# EAGLE design SNES-GamePad (EAGLE 6.2)
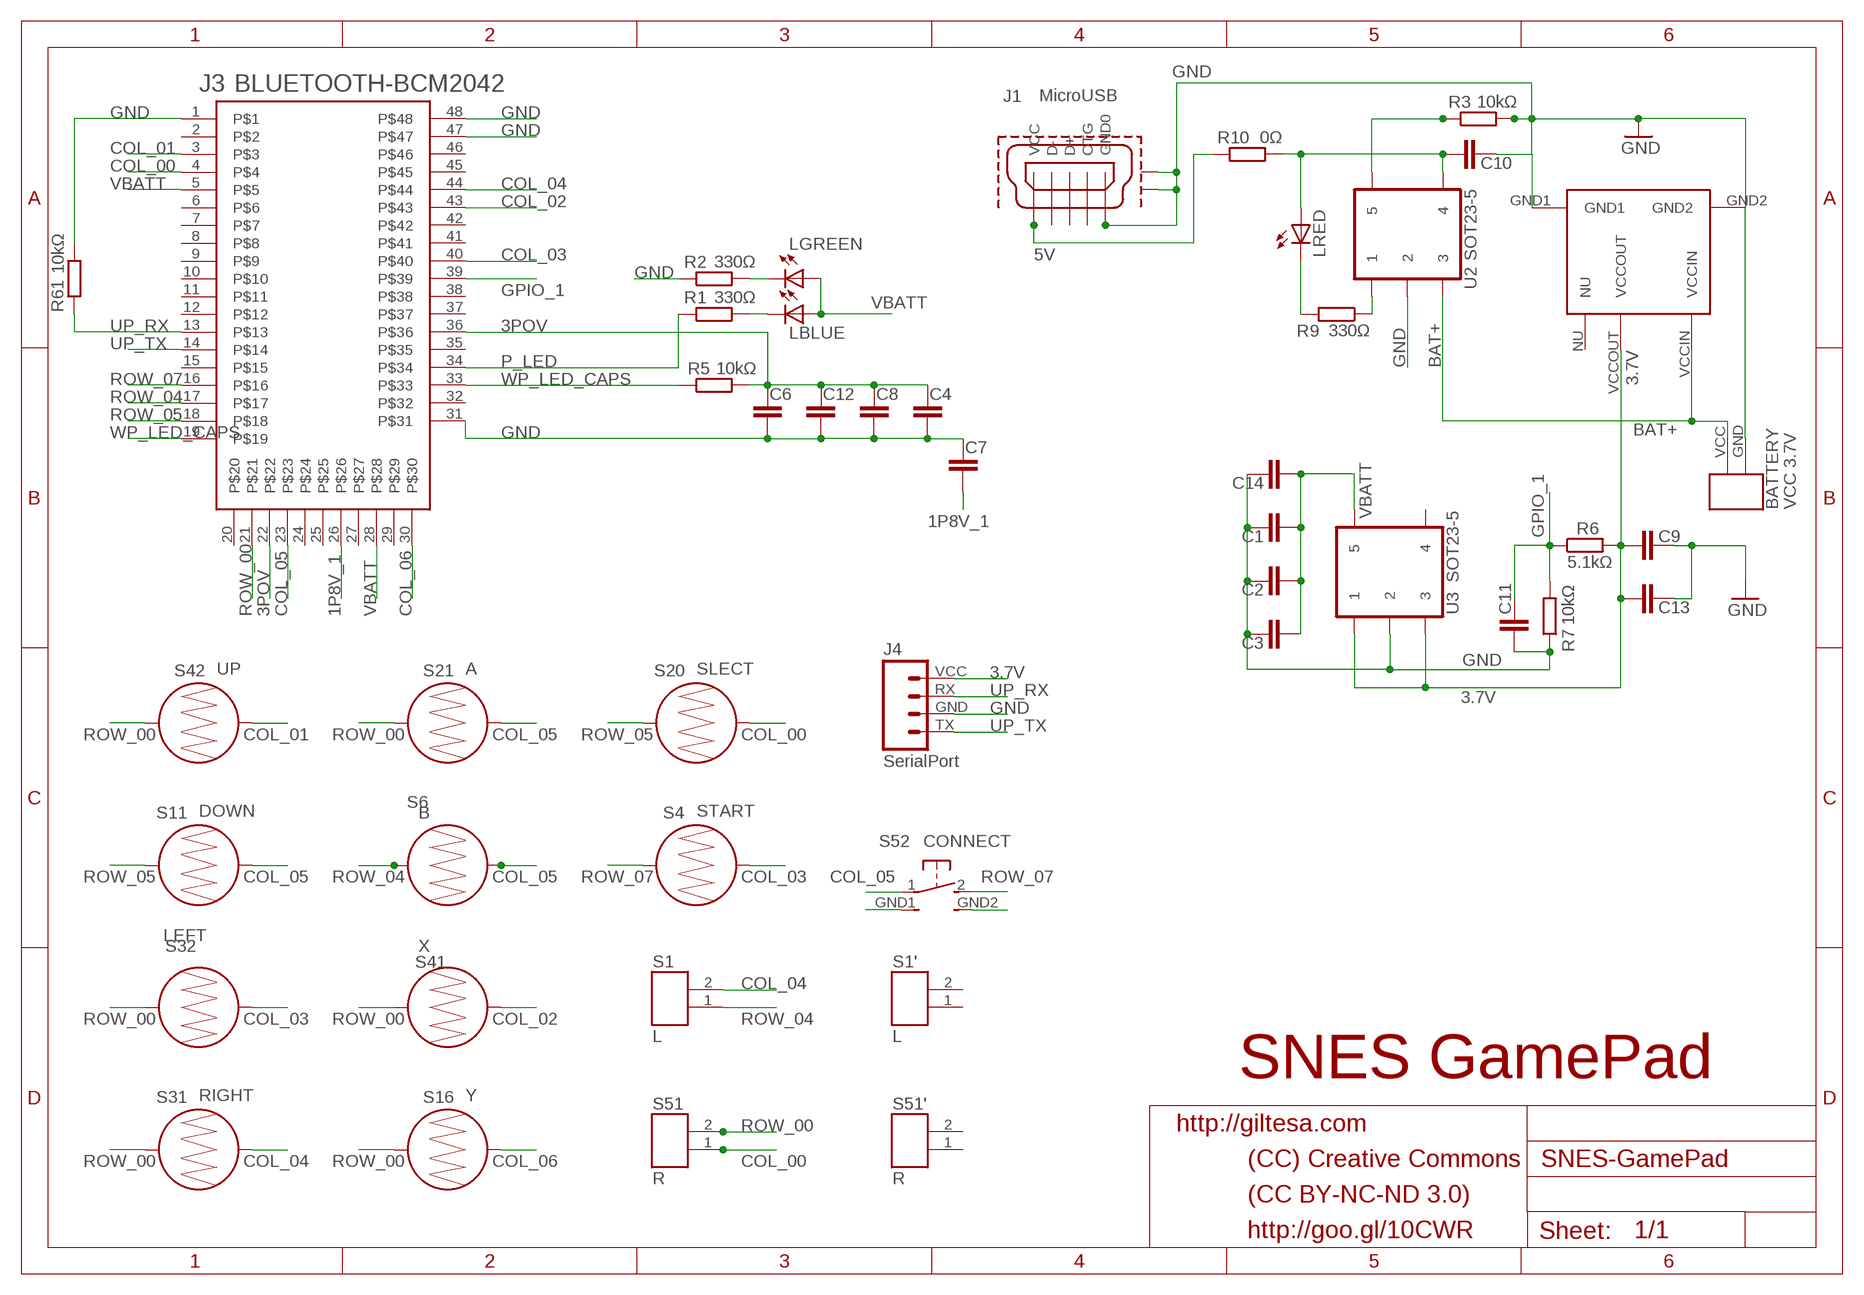
[diagram p0: schematic, sheet 1]

## Parts
BATTERY  VCC 3.7V  1X02_SMD_BIG  [1X02_SMD_BIG]
C1  C-EUC0603  [C0603]
C2  C-EUC0805  [C0805]
C3  C-EUC0805  [C0805]
C4  C-EUC0603  [C0603]
C6  C-EUC0805  [C0805]
C7  C-EUC0805  [C0805]
C8  C-EUC0805  [C0805]
C9  C-EUC0805  [C0805]
C10  C-EUC0603  [C0603]
C11  C-EUC0603  [C0603]
C12  C-EUC0805  [C0805]
C13  C-EUC0805  [C0805]
C14  C-EUC0805  [C0805]
J1  MicroUSB  MICRO_USB_1  [MICRO_USB_1]
J2  INTERRUPTOR_1  [INTERRUPTOR_1]
J3  BLUETOOTH-BCM2042  [BLUETOOTH-BCM2042]
J4  SerialPort  ISP_PORT_SNES  [ISP_PORT_SNES]
LBLUE  LEDCHIPLED_0805  [CHIPLED_0805]
LGREEN  LEDCHIPLED_0805  [CHIPLED_0805]
LRED  LEDCHIPLED_0805  [CHIPLED_0805]
R1  330Ω  R-EU_R0603  [R0603]
R2  330Ω  R-EU_R0603  [R0603]
R3  10kΩ  R-EU_R0603  [R0603]
R5  10kΩ  R-EU_R0603  [R0603]
R6  5.1kΩ  R-EU_R0603  [R0603]
R7  10kΩ  R-EU_R0603  [R0603]
R9  330Ω  R-EU_R0603  [R0603]
R10  0Ω  R-EU_R0603  [R0603]
R61  10kΩ  R-EU_R0603  [R0603]
S1  L  1X02_SMD  [1X02_SMD]
S1'  L  SNES_GAMEPAD_RL  [SNES_GAMEPAD_RL]
S4  START  BUTTON-CONDUCTIVE-BUTTON  [BUTTON-CONDUCTIVE-BUTTON]
S6  B  BUTTON-CONDUCTIVE-BUTTON  [BUTTON-CONDUCTIVE-BUTTON]
S11  DOWN  BUTTON-CONDUCTIVE-PAD  [BUTTON-CONDUCTIVE-PAD]
S16  Y  BUTTON-CONDUCTIVE-BUTTON  [BUTTON-CONDUCTIVE-BUTTON]
S20  SLECT  BUTTON-CONDUCTIVE-BUTTON  [BUTTON-CONDUCTIVE-BUTTON]
S21  A  BUTTON-CONDUCTIVE-BUTTON  [BUTTON-CONDUCTIVE-BUTTON]
S31  RIGHT  BUTTON-CONDUCTIVE-PAD  [BUTTON-CONDUCTIVE-PAD]
S32  LEFT  BUTTON-CONDUCTIVE-PAD  [BUTTON-CONDUCTIVE-PAD]
S41  X  BUTTON-CONDUCTIVE-BUTTON  [BUTTON-CONDUCTIVE-BUTTON]
S42  UP  BUTTON-CONDUCTIVE-PAD  [BUTTON-CONDUCTIVE-PAD]
S51  R  1X02_SMD  [1X02_SMD]
S51'  R  SNES_GAMEPAD_RL  [SNES_GAMEPAD_RL]
S52  CONNECT  SWITCH-90º  [SWITCH-90º]
U2  SOT23-5  [SOT23-5]
U3  SOT23-5  [SOT23-5]

## Nets
1P8V_1: C7.1 J3.26
3.7V: C9.2 C13.2 J2.VCCOUT J4.VCC R6.2 U3.1 U3.3
3POV: C4.1 C6.1 C8.1 C12.1 J3.22 J3.36 R5.2
5V: J1.VCC R10.1
BAT+: BATTERY.VCC J2.VCCIN U2.3
COL_00: J3.4 S20.2 S51.1
COL_01: J3.3 S42.2
COL_02: J3.43 S41.1
COL_03: J3.40 S4.2 S32.1
COL_04: J3.44 S1.2 S31.2
COL_05: J3.23 S6.1 S11.2 S21.2 S52.1
COL_06: J3.30 S16.2
GND: BATTERY.GND C1.1 C2.1 C3.1 C4.2 C6.2 C7.2 C8.2 C9.1 C10.2 C11.1 C12.2 C13.1 C14.1 J1.GND0 J1.GND1 J1.GND2 J2.GND1 J2.GND2 J3.1 J3.31 J3.47 J3.48 J4.GND R2.1 R3.2 R7.1 R61.2 S52.GND1 S52.GND2 U2.2 U3.2
GPIO_1: C11.2 J3.39 R6.1 R7.2
N$5: LBLUE.C R1.2
N$6: C10.1 LRED.A R10.2 U2.4
N$7: J1.D+
N$17: LRED.C R9.2
N$19: R3.1 U2.5
N$30: LGREEN.C R2.2
N$37: R9.1 U2.1
P_LED: J3.34 R1.1
ROW_00: J3.21 S16.1 S21.1 S31.1 S32.2 S41.2 S42.1 S51.2
ROW_04: J3.17 S1.1 S6.2
ROW_05: J3.18 S11.1 S20.1
ROW_07: J3.16 S4.1 S52.2
UP_RX: J3.13 J4.RX R61.1
UP_TX: J3.14 J4.TX
VBATT: C1.2 C2.2 C3.2 C14.2 J3.5 J3.28 LBLUE.A LGREEN.A U3.5
WP_LED_CAPS: J3.19 J3.33 R5.1
Unconnected: J1.D- J1.OTG J2.NU J3.2 J3.6 J3.7 J3.8 J3.9 J3.10 J3.11 J3.12 J3.15 J3.20 J3.24 J3.25 J3.27 J3.29 J3.32 J3.35 J3.37 J3.38 J3.41 J3.42 J3.45 J3.46 S1'.1 S1'.2 S51'.1 S51'.2 U3.4

## Notes on the sheet
- SNES GamePad
- http://giltesa.com
- (CC) Creative Commons
- (CC BY-NC-ND 3.0)
- http://goo.gl/10CWR

## Library data of the parts
BATTERY = ,giltesa:1X02_SMD_BIG
C1-C4 C6-C14 = rcl:C-EU: CAPACITOR, European symbol
J1 = ,giltesa:MICRO_USB_1
J2 = ,giltesa:INTERRUPTOR_1
J3 = ,giltesa:BLUETOOTH-BCM2042
J4 = ,giltesa:ISP_PORT_SNES
LBLUE LGREEN LRED = led:LED: LED OSRAM: - CHIPLED LG R971, LG N971, LY N971, LG Q971, LY Q971, LO R971, LY R971 LH N974, LH R974 LS Q976, LO Q976, LY Q976 LO Q996 - Hyper CHIPLED LW Q18S LB Q993, LB Q99A, LB R99A - SideLED LS A670, LO A670, LY A670, LG A670, LP A670 LB A673, LV A673, LT A673, LW A673 LH A674 LY A675 LS A676, LA A676, LO A676, LY A676, LW A676 LS A679, LY A679, LG A679 - Hyper Micro SIDELED® LS Y876, LA Y876, LO Y876, LY Y876 LT Y87S - SmartLED LW L88C, LW L88S LB L89C, LB L89S, LG L890 LS L89K, LO L89K, LY L89K LS L896, LA L896, LO L896, LY L896 - TOPLED LS T670, LO T670, LY T670, LG T670, LP T670 LSG T670, LSP T670, LSY T670, LOP T670, LYG T670 LG T671, LOG T671, LSG T671 LB T673, LV T673, LT T673, LW T673 LH T674 LS T676, LA T676, LO T676, LY T676, LB T676, LH T676, LSB T676, LW T676 LB T67C, LV T67C, LT T67C, LS T67K, LO T67K, LY T67K, LW E67C LS E67B, LA E67B, LO E67B, LY E67B, LB E67C, LV E67C, LT E67C LW T67C LS T679, LY T679, LG T679 LS T770, LO T770, LY T770, LG T770, LP T770 LB T773, LV T773, LT T773, LW T773 LH T774 LS E675, LA E675, LY E675, LS T675 LS T776, LA T776, LO T776, LY T776, LB T776 LHGB T686 LT T68C, LB T68C - Hyper Mini TOPLED® LB M676 - Mini TOPLED Santana® LG M470 LS M47K, LO M47K, LY M47K Source: http://www.osram.convergy.de LUXEON: - LUMILED® LXK2-PW12-R00, LXK2-PW12-S00, LXK2-PW14-U00, LXK2-PW14-V00 LXK2-PM12-R00, LXK2-PM12-S00, LXK2-PM14-U00 LXK2-PE12-Q00, LXK2-PE12-R00, LXK2-PE12-S00, LXK2-PE14-T00, LXK2-PE14-U00 LXK2-PB12-K00, LXK2-PB12-L00, LXK2-PB12-M00, LXK2-PB14-N00, LXK2-PB14-P00, LXK2-PB14-Q00 LXK2-PR12-L00, LXK2-PR12-M00, LXK2-PR14-Q00, LXK2-PR14-R00 LXK2-PD12-Q00, LXK2-PD12-R00, LXK2-PD12-S00 LXK2-PH12-R00, LXK2-PH12-S00 LXK2-PL12-P00, LXK2-PL12-Q00, LXK2-PL12-R00 Source: www.luxeon.com KINGBRIGHT: KA-3528ASYC Source: www.kingbright.com
R1-R3 R5-R7 R9 R10 R61 = rcl:R-EU_: RESISTOR, European symbol
S1 S51 = ,giltesa:1X02_SMD
S1' S51' = ,giltesa:SNES_GAMEPAD_RL
S4 S6 S16 S20 S21 S41 = ,giltesa:BUTTON-CONDUCTIVE-BUTTON
S11 S31 S32 S42 = ,giltesa:BUTTON-CONDUCTIVE-PAD
S52 = ,giltesa:SWITCH-90º
U2 U3 = ,giltesa:SOT23-5

## Board
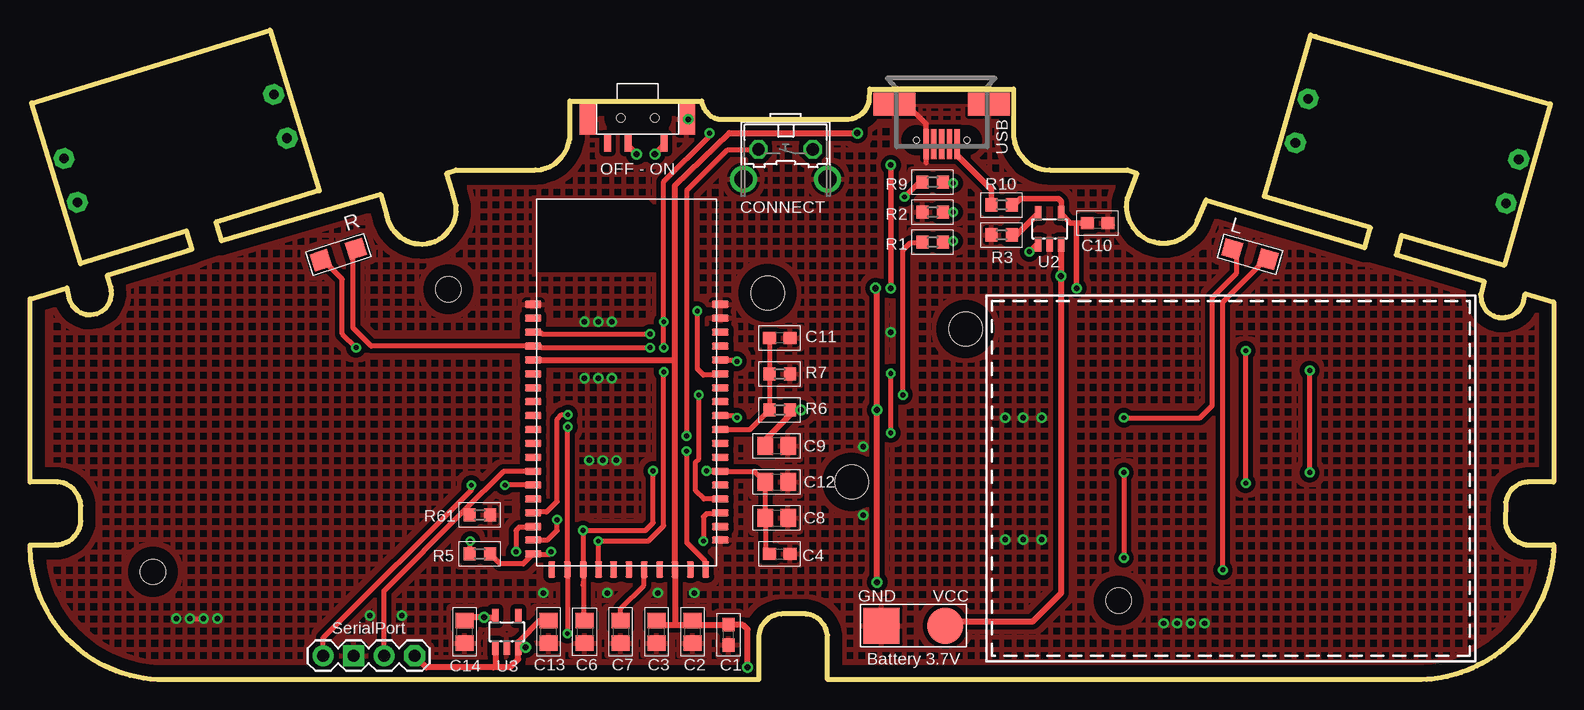
[diagram p1: board, top side]
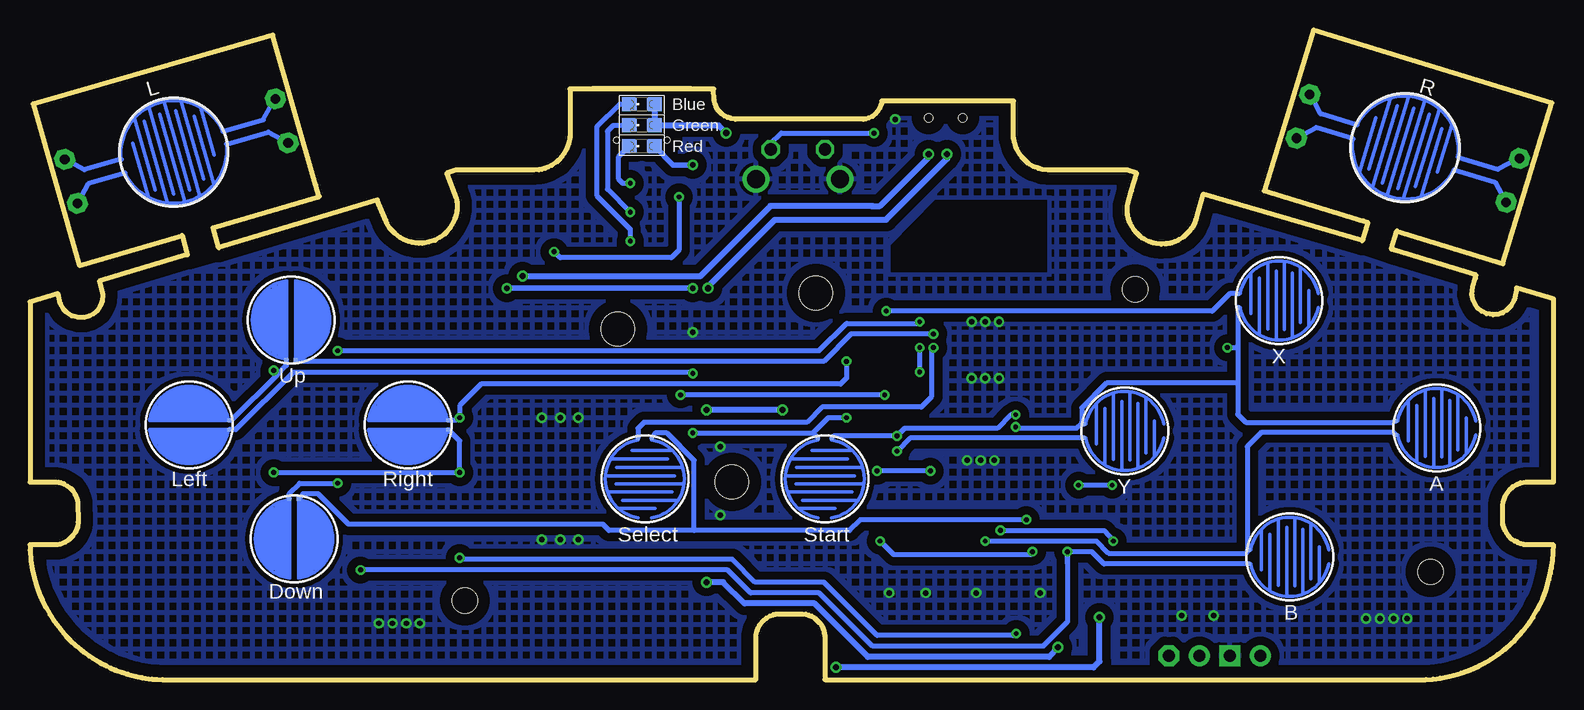
[diagram p2: board, bottom side, seen from below]

Size 127 x 54.18 mm. Coordinates in mm from the lower left corner, seen from the top.
Outline: 0,16.48 0,31.75 3.07,32.66 3.28,31.67 3.56,31.14 3.94,30.79 4.22,30.61 4.65,30.46 5.03,30.43 5.59,30.53 5.99,30.73 6.3,30.96 6.53,31.29 6.71,31.62 6.81,32.11 6.78,32.46 6.73,32.77 6.5,33.45 6.45,33.73 13.16,35.79 13.51,35.89 13.06,37.41 4.22,34.7 0.13,48.08 20.01,54.18 20.14,53.75 24.11,40.77 15.82,38.25 15.49,38.15 15.95,36.6 29.21,40.49 29.72,38.76 29.77,38.58 29.82,38.38 29.9,38.18 30.12,37.72 30.2,37.62 30.33,37.44 30.43,37.31 30.63,37.11 30.79,36.98 30.91,36.88 31.19,36.7 31.32,36.63 31.52,36.55 31.78,36.45 31.95,36.4 32.08,36.37 32.26,36.35 32.36,36.35 32.72,36.32 33.12,36.37 33.35,36.42 33.55,36.47 33.76,36.55 34.14,36.75 34.32,36.85 34.44,36.96 34.75,37.24 34.98,37.52 35.18,37.85 35.31,38.07 35.43,38.46 35.51,38.79 35.54,39.01 35.54,39.55 35.18,40.77 34.75,42.24 35.51,42.49 42.11,42.49 42.62,42.54 42.95,42.65 43.36,42.8 43.76,43.05 44.07,43.31 44.3,43.56 44.53,43.87 44.76,44.3 44.91,44.75 44.98,45.03 45.01,45.16 45.01,48.25 55.98,48.25 56.03,48.01 56.06,47.95 56.19,47.62 56.34,47.4 56.57,47.14 56.77,46.99 57.07,46.84 57.35,46.76 57.56,46.74 68.22,46.74 68.55,46.79 68.86,46.89 69.11,47.02 69.32,47.17 69.57,47.42 69.67,47.55 69.82,47.83 69.9,48.03 69.95,48.18 69.98,48.34 70,49.25 81.99,49.25 81.99,45.26 82.09,44.7 82.22,44.37 82.32,44.14 82.47,43.89 82.65,43.64 82.93,43.33 83.16,43.13 83.52,42.9 83.8,42.75 84.05,42.65 84.33,42.57 84.58,42.52 85.01,42.49 91.52,42.49 92.25,42.24 91.46,40.16 91.41,39.83 91.39,39.45 91.41,39.14 91.49,38.73 91.57,38.51 91.59,38.38 91.72,38.12 91.97,37.69 92.28,37.31 92.48,37.13 92.84,36.88 93.22,36.65 93.75,36.5 94.11,36.42 94.28,36.4 94.59,36.4 94.87,36.42 95.17,36.47 95.45,36.55 95.66,36.63 95.88,36.73 96.14,36.88 96.37,37.03 96.57,37.21 96.75,37.36 96.9,37.54 97,37.67 97.26,38.07 97.33,38.25 98.04,40 111.25,36.02 111.73,37.69 102.89,40.28 103.17,41.25 106.76,53.75 107.19,53.62 126.75,48.01 122.88,34.54 114.32,37.03 113.89,35.43 121.21,33.22 120.93,32.13 120.98,31.57 121.16,31.14 121.41,30.76 121.72,30.51 122.02,30.33 122.45,30.2 122.99,30.2 123.55,30.35 123.98,30.66 124.18,30.89 124.46,31.37 124.66,32.18 127,31.5 127,16.48 124.84,16.48 124.61,16.46 124.41,16.41 124.18,16.33 123.88,16.15 123.65,15.98 123.44,15.77 123.24,15.44 123.09,15.11 123.01,14.81 122.99,13.13 123.04,12.78 123.24,12.27 123.42,11.99 123.82,11.63 124.05,11.48 124.48,11.3 124.69,11.25 127,11.25 127,10.8 126.92,9.91 126.8,9.2 126.64,8.51 126.47,7.9 126.34,7.52 126.14,6.99 125.98,6.63 125.7,6.07 125.32,5.41 124.94,4.83 123.98,3.63 123.67,3.33 123.16,2.85 122.78,2.52 122.53,2.31 122.07,1.98 121.79,1.8 121.46,1.6 121.16,1.42 120.62,1.14 120.29,0.99 119.84,0.79 119.33,0.61 118.85,0.46 118.19,0.28 117.65,0.18 116.81,0.05 116.43,0.03 115.98,0 66.5,0 66.5,3.71 66.4,4.09 66.32,4.29 66.19,4.55 65.89,4.93 65.61,5.16 65.33,5.31 65.02,5.41 64.85,5.46 64.67,5.49 62.64,5.49 62.33,5.46 62.1,5.38 61.85,5.28 61.62,5.16 61.42,5 61.19,4.75 60.98,4.47 60.91,4.29 60.86,4.17 60.78,3.86 60.73,3.63 60.73,0 10.64,0 10.06,0.05 9.45,0.13 8.33,0.36 7.72,0.53 7.16,0.74 6.65,0.94 6.17,1.17 5.77,1.37 5.26,1.68 4.65,2.08 4.06,2.54 3.5,3.02 3.23,3.3 2.85,3.71 2.54,4.06 2.29,4.39 1.98,4.8 1.73,5.18 1.4,5.77 1.09,6.33 0.91,6.73 0.61,7.54 0.38,8.33 0.25,8.86 0.18,9.3 0.08,9.93 0,11.23 2.13,11.25 2.36,11.25 2.49,11.28 2.72,11.33 3,11.43 3.25,11.56 3.5,11.73 3.73,11.99 3.91,12.22 4.04,12.45 4.12,12.6 4.22,12.93 4.24,13.23 4.24,14.53 4.19,14.86 4.17,14.96 4.04,15.32 3.66,15.85 3.4,16.08 3.07,16.28 2.77,16.41 2.31,16.48 0,16.48
Copper layers (1*16): Top 0.035mm / dielectric 1.5mm / Bottom 0.035mm
Design rules: minimum track width 10mil, minimum drill 24mil, track to track 8mil, track to pad 8mil, pad to pad 8mil, via to via 8mil, smd to smd 8mil, copper to edge 40mil, drill to drill 8mil, minimum pad ring 10mil, minimum via ring 8mil, stop-mask expansion 4mil, vias tented up to drill 25mil, thermal gap 10mil
Holes 2.8 mm at 61.5,32.24 78,29.24 68.5,16.49
Holes 2.1 mm at 10.25,8.99 90.75,6.59 34.87,32.57

### Footprints (pad centres in the part's own frame; a part is rotated, then mirrored left to right if it is on the bottom)
1X02_SMD_BIG = smd 3 x 3: GND -2.75,0; VCC 2.56,0
C0603 = smd 1.1 x 1: 1 -0.85,0; 2 0.85,0
C0805 = smd 1.3 x 1.5: 1 -0.95,0; 2 0.95,0
MICRO_USB_1 = smd 2.5 x 0.45: D+ 3.35,0; D- 3.35,0.65; GND0 3.35,-1.3; OTG 3.35,-0.65; VCC 3.35,1.3 | smd 1.9 x 3.5: GND1 0,3.95; GND2 0,-3.95 | hole 0.5: 3,2.1; 3,-2.1
INTERRUPTOR_1 = smd 1.4 x 2.54: GND1 -0.75,1.232; GND2 7.5,1.232 | smd 0.6 x 1.4: NU 0.9,-0.75; VCCIN 5.6,-0.75; VCCOUT 2.6,-0.75 | hole 0.7: 2,1.36; 4.85,1.36
BLUETOOTH-BCM2042 = smd 1.4 x 0.6: 1 -0.3,21.81; 2 -0.3,20.65; 3 -0.3,19.49; 4 -0.3,18.33; 5 -0.3,17.17; 6 -0.3,16.01; 7 -0.3,14.85; 8 -0.3,13.69; 9 -0.3,12.53; 10 -0.3,11.37; 11 -0.3,10.21; 12 -0.3,9.05; 13 -0.3,7.89; 14 -0.3,6.73; 15 -0.3,5.57; 16 -0.3,4.42; 17 -0.3,3.27; 18 -0.3,2.15; 19 -0.3,1; 31 15.3,2.15; 32 15.3,3.27; 33 15.3,4.42; 34 15.3,5.57; 35 15.3,6.73; 36 15.3,7.89; 37 15.3,9.05; 38 15.3,10.21; 39 15.3,11.37; 40 15.3,12.53; 41 15.3,13.69; 42 15.3,14.85; 43 15.3,16.01; 44 15.3,17.17; 45 15.3,18.33; 46 15.3,19.49; 47 15.3,20.65; 48 15.3,21.81 | smd 0.6 x 1.4: 20 1.25,-0.3; 21 2.55,-0.3; 22 3.88,-0.3; 23 5.15,-0.3; 24 6.4,-0.3; 25 7.68,-0.3; 26 8.96,-0.3; 27 10.24,-0.3; 28 11.52,-0.3; 29 12.8,-0.3; 30 14.08,-0.3
ISP_PORT_SNES = drill 1.016 pad 1.778 square: GND -1.27,0 | drill 1.016 pad 1.778: RX 1.27,0; TX -3.81,0 | drill 1.016 pad 1.778 octagon: VCC 3.81,0
CHIPLED_0805 = smd 1.2 x 1.2: A 0,-1.05; C 0,1.05
R0603 = smd 1 x 1.1: 1 -0.85,0; 2 0.85,0
1X02_SMD = smd 1.5 x 1.5: 1 -1.48,0.02; 2 1.58,0.02
SNES_GAMEPAD_RL = drill 0.8 pad 1.676 octagon: 1 1.27,5.08; 1' 19.55,5.08; 2 1.27,1.27; 2' 19.55,1.27
BUTTON-CONDUCTIVE-BUTTON = smd 0.305 x 0.305: 1 3.41,-0.577; 2 3.412,0.577
BUTTON-CONDUCTIVE-PAD = smd 0.305 x 0.305: 1 -3.334,0.396; 2 -3.334,-0.396
SWITCH-90º = drill 1.016 octagon: 1 -2.261,-1.245; 2 2.261,-1.245 | drill 1.499 pad 2.159: GND1 -3.505,1.245; GND2 3.505,1.245
SOT23-5 = smd 0.55 x 1.2: 1 -0.95,-1.3; 2 0,-1.3; 3 0.95,-1.3; 4 0.95,1.3; 5 -0.95,1.3

### Placement (x,y rotation side)
BATTERY  73.75,4.49 0 top
C1  58.25,3.74 90 top
C2  55.25,3.99 90 top
C3  52.25,3.99 90 top
C4  62.5,10.49 0 top
C6  46.25,3.99 270 top
C7  49.25,3.99 270 top
C8  62.25,13.49 0 top
C9  62.25,19.49 180 top
C10  89,38.09 0 top
C11  62.5,28.49 180 top
C12  62.25,16.49 0 top
C13  43.25,3.99 90 top
C14  36.25,3.99 90 top
J1  76,47.99 270 top
J2  47.25,45.49 0 top
J3  42.25,9.49 0 top
J4  28.25,1.99 0 top
LBLUE  76,47.99 90 bottom
LGREEN  76,46.24 90 bottom
LRED  76,44.49 90 bottom
R1  75.25,36.49 0 top
R2  75.25,38.99 0 top
R3  81,37.09 180 top
R5  37.5,10.49 180 top
R6  62.5,22.49 0 top
R7  62.5,25.49 180 top
R9  75.25,41.49 0 top
R10  81,39.59 0 top
R61  37.5,13.74 0 top
S1  101.75,35.49 164 top
S1'  123.93,38.16 16 bottom
S4  60.75,16.74 90 bottom
S6  22,10.24 180 bottom
S11  105,11.74 270 bottom
S16  35.75,20.74 180 bottom
S20  75.75,16.74 90 bottom
S21  9.75,20.99 180 bottom
S31  95.5,21.24 180 bottom
S32  113.75,21.24 180 bottom
S41  22.87,31.61 180 bottom
S42  105.25,29.99 90 bottom
S51  25.75,35.49 198 top
S51'  23.02,44.32 343 bottom
S52  62.99,42.98 180 top
U2  85,37.59 0 top
U3  39.75,3.99 0 top

### Tracks (layer width: path | path; a pad name or v marks a point on that pad's centre or on a via)
1P8V_1
  Top 0.406: C7.1 49.25,5.94 51.18,7.87 51.18,9.17 J3.26
3.7V  (via drill 0.51)
  Top 0.508: 63.36,22.48 R6.2 | R6.2 63.35,22.07 61.34,20.07 61.34,19.54 C9.2 | R6.2 64.25,22.49 v64.26,22.48 | U3.3 v41.3,2.69 | 38.61,1.02 40.01,1.02 40.7,1.71 U3.3 | 38.61,1.02 33.03,1.02 J4.VCC | U3.1 38.8,1.2 38.61,1.02 | C13.2 42.53,4.94 40.77,3.17 40.77,2.76 U3.3 | v70.61,8.13 v70.61,22.48 70.61,32.51 v70.48,32.64 | J2.VCCOUT 49.85,44.53 v50.56,43.81
  Bottom 0.508: v41.3,2.69 41.3,2.64 42.04,1.9 57.15,1.9 61.59,6.35 67.44,6.35 69.21,8.13 v70.61,8.13 | v64.26,22.48 v70.61,22.48 70.48,22.61 | v70.48,32.64 70.36,32.89 64.9,38.35 55.63,38.35 50.55,43.43 50.55,43.8 v50.56,43.81
3POV  (via drill 0.41)
  Top 0.406: C4.1 61.3,10.84 C8.1 C12.1 60.41,17.38 J3.36 57.44,17.4 v56.39,17.4 | J3.22 46.13,5.06 | J3.22 46.13,8.15 46.1,7.87 | R5.2 36.7,10.43 v36.7,11.56 | J3.22 46.1,9.22 v46.1,12.45 51.31,12.45 51.94,13.08 v51.94,17.4
  Top 0.508: 46.13,5.06 C6.1
  Bottom 0.406: v51.94,17.4 v56.39,17.4 | v46.1,12.45 37.47,12.45 v36.7,11.56
5V
  Top 0.457: J1.VCC 77.3,43.71 80.15,40.86 R10.1
BAT+  (via drill 0.51)
  Top 0.508: BATTERY.VCC 76.64,4.83 83.57,4.83 85.95,7.21 v85.95,33.65 U2.3 | J2.VCCIN 52.85,44.57 v52.09,43.81
  Bottom 0.508: v85.95,33.65 71.12,33.65 65.28,39.5 56.9,39.5 56.9,39.51 56.78,39.51 56.77,39.5 56.13,39.5 52.07,43.56 52.07,43.8 v52.09,43.81
COL_00  (via drill 0.41)
  Top 0.406: 27.3,35.78 S51.1 26.92,35.7 26.92,29.34 28.44,27.82 J3.4 42.54,27.82 42.67,27.69 v51.69,27.69
  Bottom 0.406: S20.2 76.33,20.33 76.33,20.96 75.82,21.46 62.23,21.46 60.96,22.73 52.71,22.73 51.82,23.62 51.82,27.56 v51.69,27.69
COL_01  (via drill 0.41)
  Top 0.406: J3.3 42.52,28.98 42.67,28.83 v51.69,28.83
  Bottom 0.406: v51.69,28.83 58.55,28.83 60.83,26.54 104.74,26.54 S42.2
COL_02  (via drill 0.41)
  Top 0.406: J3.43 57.44,25.4 56.13,25.4 55.63,25.91 v55.63,30.73
  Bottom 0.406: v55.63,30.73 28.45,30.73 26.99,32.19 S41.1
COL_03  (via drill 0.41)
  Top 0.406: v71.75,20.57 v71.75,25.53 | J3.40 58.75,22.02 v58.93,21.84
  Bottom 0.406: v71.75,25.53 71.88,25.65 105.03,25.65 109.84,20.85 S32.1 | v58.93,21.84 60.47,21.84 61.74,20.57 | v71.75,20.57 61.74,20.57 | 61.74,20.57 S4.2
COL_04  (via drill 0.41)
  Top 0.406: J3.44 58.81,26.66 v58.93,26.54 | v91.19,21.84 97.54,21.84 98.55,22.86 98.55,31.88 100.58,33.91 100.58,35.18 100.58,35.55 S1.2
  Bottom 0.406: v58.93,26.54 58.93,25.15 59.44,24.64 89.41,24.64 91.19,22.86 v91.19,21.84 91.52,21.64 S31.2
COL_05  (via drill 0.41)
  Top 0.406: J3.23 47.37,9.22 v47.37,11.56 51.56,11.56 52.83,12.83 v52.83,25.65 | v52.83,27.69 v52.83,29.85 52.83,41.53 56.64,45.34 v56.64,45.57 | v101.35,16.38 v101.35,27.43
  Bottom 0.406: v52.83,25.65 v52.83,27.69 | v56.64,45.57 56.9,45.59 64.39,45.59 65.25,44.73 S52.1 65.28,44.2 | v47.37,11.56 38.1,11.56 37.08,10.54 25.61,10.54 S6.1 25.53,10.67 25.53,19.43 24.31,20.65 13.41,20.65 S21.2 | S11.2 105.39,15.51 104.52,16.38 v101.35,16.38 | v101.35,27.43 61.21,27.43 58.93,29.72 52.96,29.72 v52.83,29.85
COL_06  (via drill 0.41)
  Top 0.406: v54.74,19.05 54.74,11.43 56.26,9.91 56.26,9.26 J3.30
  Bottom 0.406: S16.2 53.64,20.15 v54.74,19.05
GND  (via drill 0.46)
  Top 0.406: R2.1 | 74.7,44.09 74.7,43.08 | v13.34,5.08 v14.48,5.08
  Top 0.457: 74.7,44.09 J1.GND0 74.68,44.66 74.68,46.35 73.04,47.99 J1.GND2
  other vias: 46.23,29.85 47.37,29.85 48.51,29.85 46.23,25.15 47.37,25.15 48.51,25.15 46.61,18.29 47.75,18.29 48.9,18.29 81.28,21.84 82.8,21.84 84.33,21.84 28.32,5.33 30.99,5.33 55.37,7.24 52.32,7.24 48.13,7.24 42.8,7.24 69.47,13.72 69.47,19.43 71.75,28.96 94.49,4.7 95.63,4.7 96.77,4.7 97.92,4.7 12.19,5.08 15.62,5.08 54.86,46.74 81.28,11.68 82.8,11.68 84.33,11.68
  pour Top (isolate 0.4, hatched): -0.75,-1.14 127.75,-1.14 127.75,31.99 114.75,35.99 113.75,33.99 110.25,34.99 111.25,36.99 82.75,45.99 82.75,49.99 43.75,49.99 43.75,45.49 16.25,36.99 16.75,35.49 13.75,34.49 13.25,35.99 -0.75,31.99
  pour Bottom (isolate 0.7, hatched): -1.25,-1.25 128.75,-1.25 128.75,33.13 114.75,36.99 113.75,33.99 110.25,34.99 111.25,37.99 84.25,46.99 84.25,50.99 42.25,50.99 42.25,46.49 15.75,38.49 16.75,35.49 13.75,34.49 12.75,37.49 -1.75,32.99
GPIO_1
  Top 0.406: C11.2 R7.2 R6.1 60.02,20.86 J3.39
N$1
  cutout Top: 42.25,39.99 42.25,33.99 55.21,33.99 55.21,36.22 51.57,39.99
N$2
  cutout Bottom: 42.25,39.99 42.25,33.99 55.21,33.99 55.21,36.22 51.57,39.99
N$5  (via drill 0.41)
  Top 0.406: R1.2 76.18,36.58 v76.96,36.58
  Bottom 0.406: 77.36,48.12 LBLUE.C 77.06,48.01 77.85,48.01 79.76,46.1 79.76,40.39 76.96,37.59 v76.96,36.58
N$6  (via drill 0.46)
  Top 0.457: v71.75,42.93 v71.75,32.64 | 81.85,39.68 R10.2 82,39.59 82.55,40.13 85.72,40.13 85.98,39.88 85.98,38.92 U2.4 86.75,38.09 87.25,38.09 | v87.25,32.64 87.25,38.09 | C10.1 87.25,38.09
  Bottom 0.457: 74.78,44.32 LRED.A 73.38,42.93 v71.75,42.93 | v71.75,32.64 v87.25,32.64
N$17  (via drill 0.41)
  Top 0.406: v76.96,41.4 76.19,41.4 R9.2
  Top 0.457: 76.13,41.53 R9.2
  Bottom 0.406: LRED.C 77.98,43.56 77.98,41.78 77.6,41.4 v76.96,41.4
N$19
  Top 0.457: R3.1 82.25,37.09 U2.5
N$30  (via drill 0.41)
  Top 0.406: R2.2 v76.96,38.99
  Bottom 0.406: LGREEN.C 77.06,46.23 78.36,46.23 78.87,45.72 78.87,40.89 v76.96,38.99
N$37  (via drill 0.41)
  Top 0.406: R9.1 74.13,41.49 v72.9,40.26 | U2.1 83.91,36.29 v83.31,35.69
  Bottom 0.406: v72.9,40.26 72.9,35.81 73.53,35.18 82.8,35.18 v83.31,35.69
P_LED  (via drill 0.41)
  Top 0.406: v55.75,23.75 55.75,18.41 55.5,18.16 55.5,15.75 56.19,15.06 J3.34 | 74.23,36.32 74.35,36.45 | v72.77,23.75 72.77,35.81 73.41,36.45 74.35,36.45 | 74.35,36.45 R1.1
  Bottom 0.406: v55.75,23.75 v72.77,23.75
ROW_00  (via drill 0.41)
  Top 0.406: v44.8,3.84 J3.21 44.83,9.23 v44.83,21.08 | 24.25,34.55 S51.2 24.56,34.67 24.76,34.67 26.04,33.4 26.04,28.83 v27.18,27.69 | v91.19,17.27 v91.19,10.16 | v106.68,17.27 v106.68,25.78
  Bottom 0.406: v44.8,3.84 44.92,3.84 45.09,3.68 56.39,3.68 60.83,8.13 66.55,8.13 68.45,10.03 91.06,10.03 v91.19,10.16 | v27.18,27.69 26.45,27.69 26.32,27.81 | 26.32,24.77 37.21,24.77 39.32,22.66 39.32,21.48 S16.1 39.37,21.34 39.75,20.96 44.7,20.96 v44.83,21.08 | 26.32,24.77 26.32,22.13 25.65,21.46 13.41,21.46 S21.1 | v106.68,17.27 v91.19,17.27 91.19,19.92 S31.1 | S42.1 105.64,26.18 106.36,25.46 | S32.2 110.19,21.64 106.36,25.46 | v106.68,25.78 106.36,25.46 | S41.2 26.32,31.04 26.32,27.81 | 26.32,27.81 26.32,24.77
ROW_04  (via drill 0.41)
  Top 0.406: 42.01,12.7 J3.17 41.88,12.7 40.77,12.7 40.51,12.45 v40.51,10.67 | v99.44,9.14 99.44,31.5 102.62,34.67 102.77,34.67 S1.1
  Bottom 0.406: 40.51,9.65 v40.51,10.67 | v40.51,10.67 40.51,4.83 42.55,2.79 56.77,2.79 61.21,7.24 66.93,7.24 68.83,9.14 v99.44,9.14 | S6.2 37.47,9.65 38.48,10.67 v40.51,10.67
ROW_05  (via drill 0.41)
  Top 0.406: J3.18 43.14,11.64 43.94,12.45 v43.94,13.34
  Bottom 0.406: v43.94,13.34 57.79,13.34 58.67,12.45 71.63,12.45 | 71.63,12.45 71.63,18.29 73.91,20.57 74.89,20.57 S20.1 | 71.63,12.45 78.74,12.45 79.25,12.95 100.46,12.95 103,15.49 104.23,15.49 S11.1
ROW_07  (via drill 0.41)
  Top 0.406: S52.2 60.71,44.2 58.17,44.2 54.74,40.77 v54.74,20.32 | v44.83,22.1 44.32,22.1 43.94,21.72 43.94,14.86 43.05,13.97 42,13.97 J3.16
  Bottom 0.406: v44.83,22.1 45.21,22.1 46.36,20.96 54.1,20.96 v54.74,20.32 54.87,20.31 60.01,20.31 S4.1
UP_RX
  Top 0.406: J3.13 39.48,17.38 36.2,14.1 | R61.1 36.55,13.74 36.2,14.1 | J4.RX 29.52,7.42 36.2,14.1
UP_TX  (via drill 0.41)
  Top 0.406: J3.14 v39.59,16.22 | v36.8,16.22 36.8,15.84 24.44,3.48 J4.TX
  Bottom 0.406: v39.59,16.22 v36.8,16.22
VBATT  (via drill 0.51)
  Top 0.457: 58.48,4.83 C1.2 | 55.25,4.72 55.12,4.72 54.99,4.59 | 54.9,4.59 C2.2 | 38.71,5.21 U3.5 | 36.51,5.21 C14.2
  Top 0.508: C3.2 52.6,4.59 53.72,4.59 | C2.2 55.25,4.72 55.37,4.59 C1.2 58.27,4.57 59.44,4.57 59.82,4.19 v59.82,1.02 | 53.72,4.59 54.9,4.59 | 38.71,5.21 v37.85,5.21 36.51,5.21 | 53.72,4.59 53.77,4.64 J3.28 53.77,26.8 | J3.5 53.63,26.66 53.77,26.8 | 53.77,26.8 53.77,41.19 58.29,45.59 v68.96,45.59
  Bottom 0.508: v37.85,5.21 37.85,1.52 38.35,1.02 v59.82,1.02 | LBLUE.A LGREEN.A 74.93,46.23 69.6,46.23 v68.96,45.59
WP_LED_CAPS  (via drill 0.41)
  Top 0.406: 57.49,13.97 J3.33 57.48,13.84 56.39,13.84 56.13,13.59 v56.13,11.56 | R5.1 39.19,9.65 41.11,9.65 J3.19 | 41.91,10.46 J3.19 | v43.43,10.67 43.43,10.54 43.31,10.41 42.02,10.41 J3.19
  Bottom 0.406: v43.43,10.67 43.43,10.54 43.56,10.41 54.99,10.41 v56.13,11.56

### Text on the board
tPlace: USB | OFF - ON | L | R | GND | VCC | Battery 3.7V
bPlace: Blue | Green | Red | X | Up | Right | Left | A | Y | Start | Select | Down | B
tDocu: Button0 S1 | Button1 S51
bDocu: Button3 S41 | Button2 S42 | Button7 S21 | Button6 S16 | Button5 S31 | Button4 S32 | ButtonEnter S4 | ButtonDelete S20 | Button8 S11 | Button9 S6